# Altium schematic sheet MainBoard.SchDoc
size A2; Organization: Altium Limited; Address1: L3, 12a Rodborough Rd; Address2: Frenchs Forest; Address3: NSW; Address4: Australia 2086
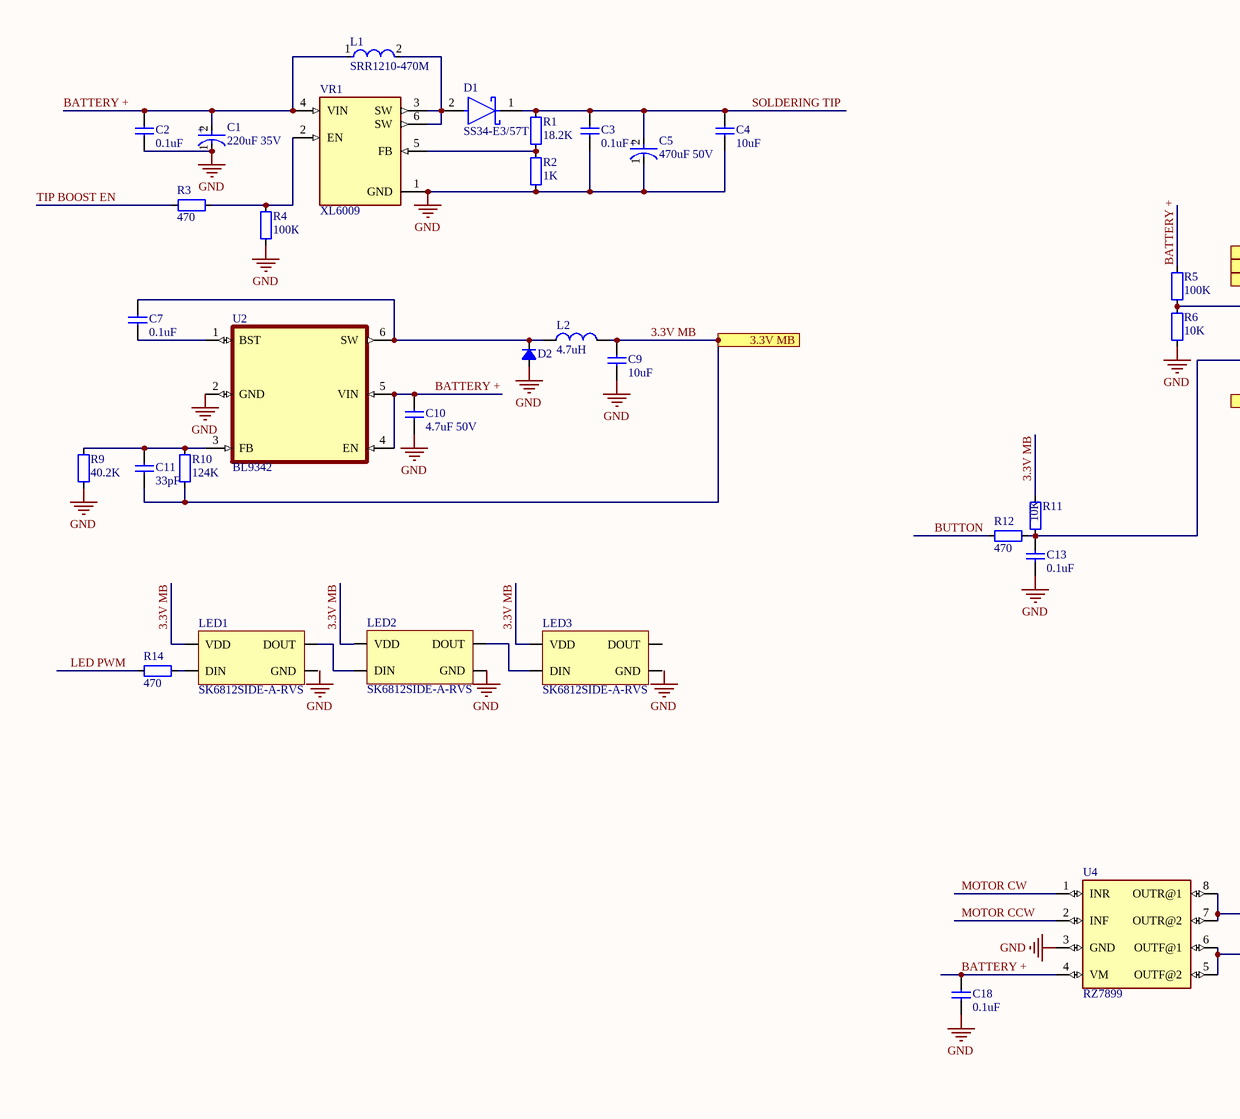
[diagram p0: MainBoard.SchDoc, left]
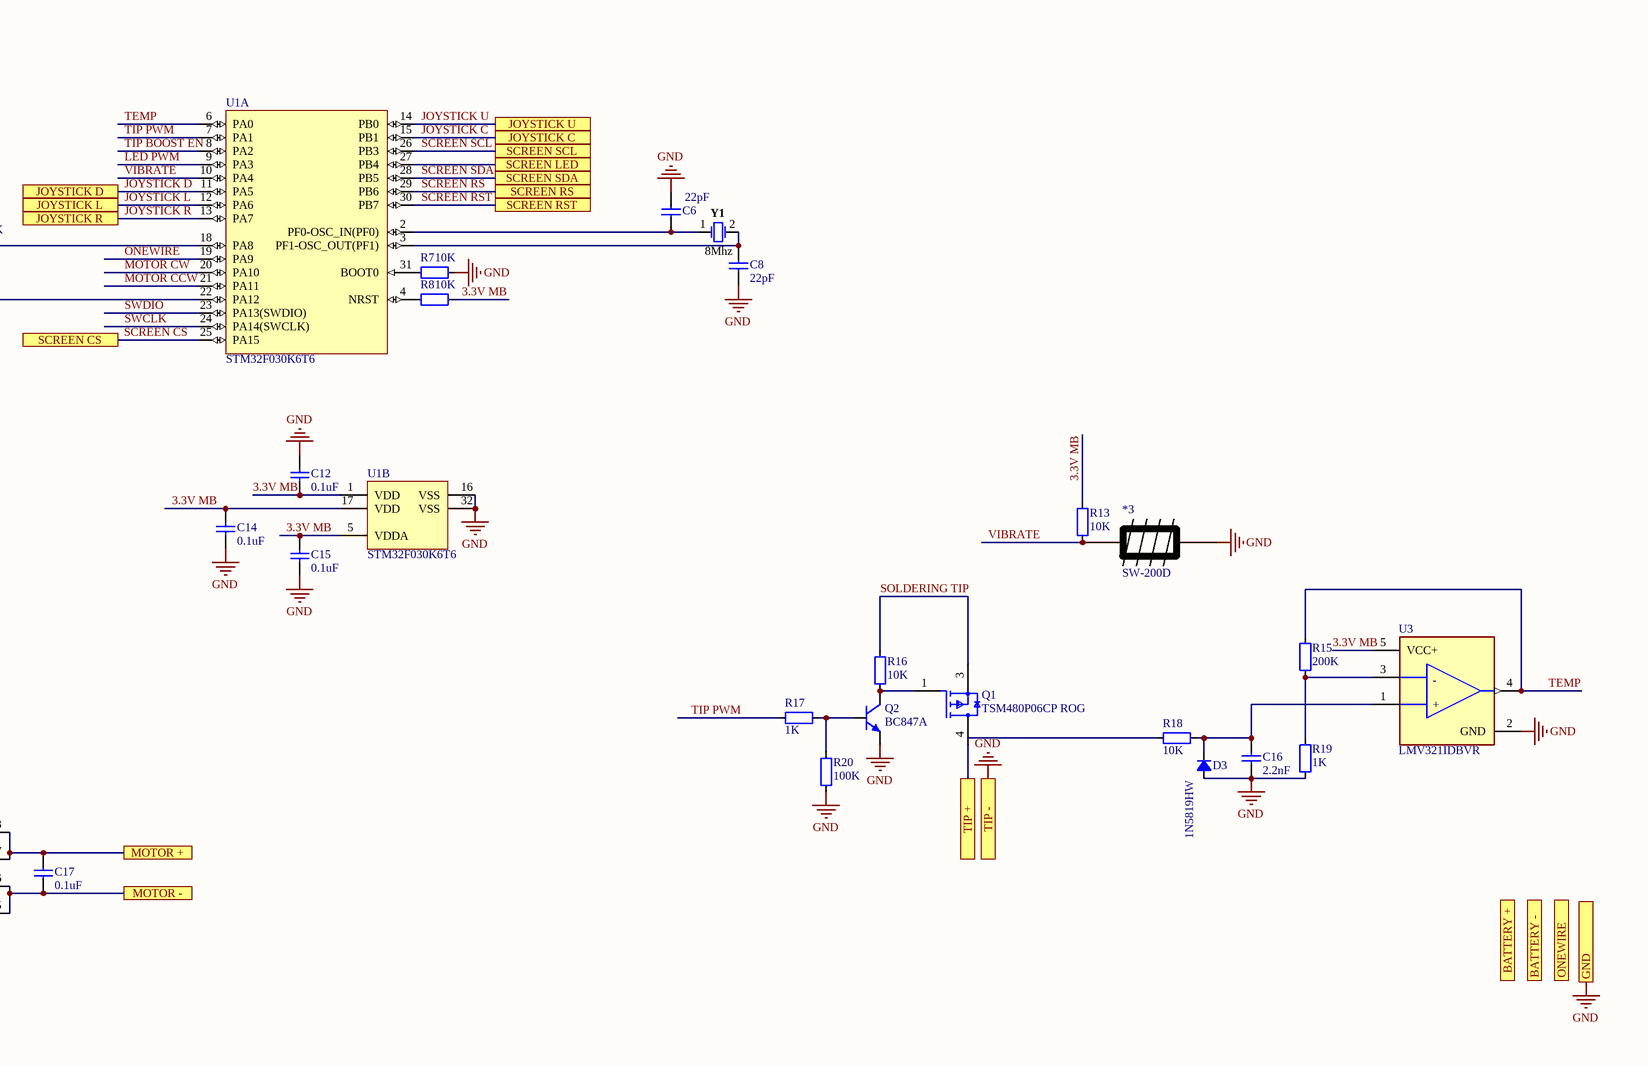
[diagram p1: MainBoard.SchDoc, right]

## Parts
*3  SW-200D  [SW-200D]
C1  220uF 35V  [FP-RAD-TH-D_8_0_5-L_15_1-MFG]
C2  0.1uF  [1206]
C3  0.1uF  [1206]
C4  10uF  [CAPC1005X04L]
C5  470uF 50V  [FP-RAD-TH-D_10_0_5-L_20_2-MFG]
C6  22pF  [R0603]
C7  0.1uF  [C0805]
C8  22pF  [R0603]
C9  10uF  [C0805]
C10  4.7uF 50V  [C0805]
C11  33pF  [C0805]
C12  0.1uF  [1206]
C13  0.1uF  [R0603]
C14  0.1uF  [1206]
C15  0.1uF  [1206]
C16  2.2nF  [C0805]
C17  0.1uF  [1206]
C18  0.1uF  [1206]
D1  SS34-E3/57T  [FP-95402-MFG]
D2  (no value)  [SOD-123]
D3  1N5819HW  [SOD-123]
L1  SRR1210-470M  [FP-SRR1210-MFG]
L2  4.7uH  [CDRH3D16NP]
LED1  SK6812SIDE-A-RVS  [SK6812SIDE-A-RVS]
LED2  SK6812SIDE-A-RVS  [SK6812SIDE-A-RVS]
LED3  SK6812SIDE-A-RVS  [SK6812SIDE-A-RVS]
Q1  TSM480P06CP ROG  [FP-TO-252-MFG]
Q2  BC847A  [SOT95P237X112-3N]
R1  18.2K  [C0805]
R2  1K  [C0805]
R3  470  [C0805]
R4  100К  [C0805]
R5  100K  [C0805]
R6  10K  [C0805]
R7  10K  [C0805]
R8  10K  [C0805]
R9  40.2K  [C0805]
R10  124K  [C0805]
R11  10K  [R0603]
R12  470  [R0603]
R13  10K  [C0805]
R14  470  [C0805]
R15  200K  [C0805]
R16  10K  [C0805]
R17  1K  [C0805]
R18  10K  [C0805]
R19  1K  [C0805]
R20  100K  [C0805]
U1  STM32F030K6T6  [LQFP32_L]  (parts A,B of 2)
U2  BL9342  [SOT50P160X60-6N]
U3  LMV321IDBVR  [FP-DBV0005A-MFG]
U4  RZ7899  [SOP-8_2-5R1S-IPC_B]
VR1  XL6009  [DPAK170P1435X465-6N]
Y1  8Mhz  [FOX-HC49SDLF_V]

## Ports
3.3V MB, BATTERY +, BATTERY -, GND, JOYSTICK C, JOYSTICK D, JOYSTICK L, JOYSTICK R, JOYSTICK U, MOTOR +, MOTOR -, ONEWIRE, SCREEN CS, SCREEN LED, SCREEN RS, SCREEN RST, SCREEN SCL, SCREEN SDA, TIP +, TIP -

## Nets
GND: *3.2 C1.1(C) C2.1 C3.1 C4.1 C5.1(C) C6.1 C8.1 C9.1 C10.1 C12.2 C13.1 C14.2 C15.2 C16.1 C18.2 D2.1(A) D3.1(A) LED2.4(GND) Q2.2(E) R2.2 R4.2 R6.1 R7.1 R9.1 R19.2 R20.1 U1.16(VSS) U1.32(VSS) U2.2(GND) U3.2(GND) U4.3(GND) VR1.1(GND) ; port TIP -, port GND
3.3V MB: C9.2 C11.1 C12.1 C14.1 C15.1 L2.2 LED1.2(VDD) LED2.2(VDD) LED3.2(VDD) R8.1 R10.1 R11.1 R13.2 U1.1(VDD) U1.5(VDDA) U1.17(VDD) U3.5(VCC+) ; port 3.3V MB
BATTERY +: C1.2(A) C2.2 C10.2 C18.1 L1.1 R5.2 U2.4(EN) U2.5(VIN) U4.4(VM) VR1.4(VIN)
BUTTON: R12.1
JOYSTICK D: U1.11(PA5) ; port JOYSTICK D
JOYSTICK L: U1.12(PA6) ; port JOYSTICK L
JOYSTICK R: U1.13(PA7) ; port JOYSTICK R
JOYSTICK U: U1.14(PB0) ; port JOYSTICK U
JOYSTICK С: U1.15(PB1) ; port JOYSTICK C
LED PWM: R14.2 U1.9(PA3)
MOTOR +: C17.1 U4.7(OUTR@2) U4.8(OUTR@1) ; port MOTOR +
MOTOR -: C17.2 U4.5(OUTF@2) U4.6(OUTF@1) ; port MOTOR -
MOTOR CCW: U1.21(PA11) U4.2(INF)
MOTOR CW: U1.20(PA10) U4.1(INR)
ONEWIRE: U1.19(PA9)
SCREEN CS: U1.25(PA15) ; port SCREEN CS
SCREEN LED: U1.27(PB4) ; port SCREEN LED
SCREEN RS: U1.29(PB6) ; port SCREEN RS
SCREEN RST: U1.30(PB7) ; port SCREEN RST
SCREEN SCL: U1.26(PB3) ; port SCREEN SCL
SCREEN SDA: U1.28(PB5) ; port SCREEN SDA
SOLDERING TIP: C3.2 C4.2 C5.2(A) D1.1(C) Q1.3(Source) R1.1 R16.2
SWCLK: U1.24(PA14(SWCLK))
SWDIO: U1.23(PA13(SWDIO))
TEMP: R15.1 U1.6(PA0) U3.4(OUT)
TIP +: Q1.4(Drain) ; port TIP +
TIP BOOST EN: R3.2 U1.8(PA2)
TIP PWM: R17.2 U1.7(PA1)
VIBRATE: *3.1 R13.1 U1.10(PA4)
NetC6_2: C6.2 U1.2(PF0-OSC_IN(PF0)) Y1.1
NetC7_1: C7.1 U2.1(BST)
NetC7_2: C7.2 D2.2(K) L2.1 U2.6(SW)
NetC8_2: C8.2 U1.3(PF1-OSC_OUT(PF1)) Y1.2
NetC11_2: C11.2 R9.2 R10.2 U2.3(FB)
NetC13_2: C13.2 R11.2 R12.2 U1.22(PA12)
NetC16_2: C16.2 D3.2(K) R18.2 U3.1(1IN+)
NetD1_2: D1.2(A) L1.2 VR1.3(SW) VR1.6(SW)
NetLED1_1: LED1.1(DIN) R14.1
NetLED1_3: LED1.3(DOUT) LED2.1(DIN)
NetLED2_3: LED2.3(DOUT) LED3.1(DIN)
NetQ1_1: Q1.1(Gate) Q2.3(C) R16.1
NetQ2_1: Q2.1(B) R17.1 R20.2
NetR1_2: R1.2 R2.1 VR1.5(FB)
NetR3_1: R3.1 R4.1 VR1.2(EN)
NetR5_1: R5.1 R6.2 U1.18(PA8)
NetR7_2: R7.2 U1.31(BOOT0)
NetR8_2: R8.2 U1.4(NRST)
NetR15_2: R15.2 R19.1 U3.3(1IN-)

Not connected (* = marked no-connect by the designer): LED1 4(GND); LED3 3(DOUT) 4(GND); R18 1

## Notes on the sheet
- Labels drawn without touching a wire or pin: GND
- Title
- Size:
- Date:
- File:
- A2
- Number:
- Time:
- Revision:
- Sheet
- of
- (in symbol CAP 10x20) +
- (in symbol CMP-05427-000678-1) +
- (in symbol LMV321) -; +

## Library data of the parts
C1 = CMP-05427-000678-1: Aluminum Electrolytic Capacitors (Radial Lead Type) 220uF ±20% 35V; Ripple Current: 1.24A; Impedance: 41mR; Lead Length: 17mm; Life (Hours): 3000Hour; Lead Diameter: 0.6mm; Dielectric Material: Aluminium; Dissipation Factor: 0.12%; Package Quantity: 200; Tolerance: 20%; Series: FM; Voltage Rating: 35V; Lead Pitch: 3.5mm; Radiation Hardening: No; Construction: RADIAL; RoHS Compliant: Yes; REACH SVHC: Yes; Lead Free: Lead Free; Height - Seated (Max): 0.65inch; Length: 15mm; Diameter: 8mm; Mount: Through Hole; Number of Pins: 2; Height: 15mm; Voltage: 35V; Case/Package: Radial; Packaging: Bulk; Min Operating Temperature: -40°C; Voltage Rating (DC): 35V; ESR (Equivalent Series Resistance): 41mR; Capacitance: 220uF; Max Operating Temperature: 105°C; Termination: Radial
C2-C4 C6-C18 = CAP
  C2 C3 C7 C12-C15 C17 C18: Value: 0.1uF
  C4 C9: Value: 10uF
  C6 C8: Value: 22pF
  C10: Value: 4.7uF 50V
  C11: Value: 33pF
  C16: Value: 2.2nF
C5 = CAP 10x20: Aluminum Electrolytic Capacitors (Radial Lead Type) 10uF ±20% 400V; Lead/Base Style: Straight; Lead Diameter: 0.6mm; Dissipation Factor: 0.24%; Ripple Current (AC): 80mA; Life (Hours): 2000Hour; Polarity: Polar; Dielectric Material: Aluminium; Lead Free: Lead Free; Capacitance: 10uF; Tolerance: 20%; Height: 20mm; Number of Pins: 2; Case/Package: Radial; Package Quantity: 200; REACH SVHC: No SVHC; Termination: Radial; Radiation Hardening: No; Diameter: 10mm; RoHS Compliant: Yes; Construction: RADIAL; Max Operating Temperature: 105°C; Voltage Rating: 400V; Mount: Through Hole; Voltage: 400V; Height - Seated (Max): 0.866inch; Lead Pitch: 5mm; Voltage Rating (DC): 400V; Contact Plating: Tin; Length: 20mm; Series: NHG; Min Operating Temperature: -25°C; Packaging: Bulk; Ripple Current: 80mA
D1 = SS34: DIODE SCHOTTKY 40V 3A DO214AB; Manufacturer: Vishay; Max Junction Temp: +150°C; Peak Reverse Current: 0.5mA; Max Surge Forward Current: 100A; Standoff Height: 0mm; ComponentLink2Description: Datasheet; Device Class L3: Schottky Diodes; Height: 2.62mm; Max Repetitive Reverse Voltage: 40V; Lead Free: Yes; Package: 95402; Temperature Range High: +150°C; ComponentLink2URL: http://www.vishay.com/docs/88751/ss32.pdf; Temperature: -55°C to +150°C; Footprint Url: http://www.vishay.com/docs/95402/smc.pdf; Automotive: No; Forward Current: 3A; Category: Diode; Manufacturer Part Number: SS34-E3/57T; RoHS: TRUE; Device Class L2: Diodes; Mouser Description: Schottky Diodes & Rectifiers 3.0 Amp 40 Volt; Octopart: https://octopart.com/ss34-e3%2F57t-vishay-39552907; Temperature Range Low: -55°C; Device Class L1: Discrete Semiconductors; Digikey Description: DIODE SCHOTTKY 40V 3A DO214AB
D2 = Diode_SOD123: Schottky diode SOD123; Note: Schottky diode  SOD123
D3 = Diode_SOD123: Schottky diode SOD123 1N5819HW; Note: Schottky diode  SOD123
L1 = SRR1210: FIXED IND  102 MOHM SMD; Manufacturer: Bourns; Manufacturer Part Number: SRR1210-680M; Inductance: 68uH; Rms Current: 3A; Shielding: true; Q Factor: 12; Value: 68uH; Series Resistance: 102mΩ; Saturation Current: 2.7A; Tolerance: 20%; Core Material: Ferrite; Self Resonant Frequency: 3.8MHz; Test Frequency: 2.52MHz; ComponentLink2Description: Datasheet; Device Class L3: Fixed Inductors; Lead Free: Yes; Composition: Wirewound; Temperature: -40°C to +125°C; Automotive: No; RoHS: TRUE; Category: Ind; Device Class L2: Inductors; Height: 10mm; Temperature Range Low: -40°C; Package: SRR1210; Device Class L1: Passive Components; Temperature Range High: +125°C; Mouser Description: Fixed Inductors 68uH 20% SMD 1210; ComponentLink2URL: https://www.bourns.com/docs/Product-Datasheets/SRR1210.pdf; Digikey Description: FIXED IND 68UH 3A 102 MOHM SMD; Octopart: https://octopart.com/srr1210-680m-bourns-10487145
L2 = CDRH3D16NP: 4,7µH Shielded Inductor 900mA 140mOhm Max Nonstandard; Manufacturer: Sumida; Manufacturer Part Number: CDRH3D16NP-100NC; Note: 4.7µH Shielded Inductor 550mA 140mOhm; Value: 4.7uH
LED1-LED3 = SK6812SIDE-A-RVS: 2mA -40℃~+85℃ RGB SMD,2x4mm Light Emitting Diodes (LED) ROHS
Q1 = TSM480P06CP ROG: MOSFET P-CHANNEL 60V 20A TO252; Rds On Max: 48mR; Max Power Dissipation: 66W; Input Capacitance: 1.25nF; Mount: Surface Mount; Case/Package: TO-252-3; Min Operating Temperature: -50°C; Continuous Drain Current (ID): 20A; Drain to Source Voltage (Vdss): 60V; Packaging: Cut Tape; RoHS Compliant: Yes; Max Operating Temperature: 150°C
Q2 = BC846A: NPN Silicon AF Transistor, 45 V VCEO, 100 mA IC, SOT23, Reel, Green; Manufacturer: DIOTEC; Note: NPN Silicon AF Transistor, 45 V VCEO, 100 mA IC, SOT23, Reel, Green; ComponentLink3URL: http://www.infineon.com/dgdl/SOT23-Package_Overview.pdf?folderId=db3a30431936bc4b0119532290053c66&fileId=db3a30431936bc4b0119533468123c85; ComponentLink3Description: Package Specification; ComponentLink2URL: http://www.infineon.com/dgdl/bc847series_bc848series_bc849series_bc850series.pdf?folderId=db3a304314dca389011541d30fa21656&fileId=db3a304314dca389011541d4630a1657; ComponentLink1URL: http://www.infineon.com/; ComponentLink2Description: Datasheet; ComponentLink1Description: Manufacturer URL; Manufacturer Part Number: BC847A
R1-R20 = RES SMD UNI: Resistor SMD; Category: Resistors
  R1: Value: 18.2K
  R2 R17 R19: Value: 1K
  R3 R12 R14: Value: 470
  R4: Value: 100К
  R5 R20: Value: 100K
  R6-R8 R11 R13 R16 R18: Value: 10K
  R9: Value: 40.2K
  R10: Value: 124K
  R15: Value: 200K
U1 = CMP-0304-00020-2: ARM Cortex-M0 32-bit MCU, 32 KB Flash, 4 KB Internal RAM, 26 I/Os, 32-pin LQFP, -40 to 85 degC, Tray; I/Os (High Current): 26; FLASH Size (Prog) (kB): 32; Operating Frequency(F) (Processor speed) (MHz): 48; Supply Voltage(Vcc) min (V): 2.4; Internal RAM Size (kB): 4; PackageDescription: 32-Pin Low Profile Quad Flat Package, 7 x 7 mm Body, 0.8 mm Pitch; Core: ARM Cortex-M0; PackageVersion: Rev. 1, 07/2013; ComponentLink1Description: Manufacturer URL; ComponentLink2URL: http://www.st.com/st-web-ui/static/active/en/resource/technical/document/datasheet/DM00088500.pdf; PackageReference: LQFP32; PartNumber: STM32F030K6T6; Mounting Technology: Surface Mount; DatasheetVersion: Rev. 1; ComponentLink2Description: Datasheet; ComponentLink3URL: http://www.st.com/st-web-ui/static/active/en/resource/technical/document/datasheet/DM00088500.pdf; ComponentLink1URL: http://www.st.com/web/en/home.html; ComponentLink3Description: Package Specification; Packing: Tray
U2 = BL9342: MF: {'manufacturer': u'Texas Instruments'}; Package: None; MP: BL9342; Value: *; Price: None; Availability: Unavailable
U3 = LMV321: IC OPAMP GP 1 CIRCUIT SOT23-5; Manufacturer: Texas Instruments; Bandwidth: 1MHz; Number Of Channels: 1; Max Junction Temp: +150°C; Input Offset Voltage: 1.7mV; Standoff Height: 0mm; Voltage Gain: 100V/mV; Min Supply Voltage: 2.7V; Input Bias Current: 0.015uA; Nominal Supply Current: 80-130uA; Max Supply Voltage: 5.5V; Ambient Temperature Range Low: -40°C; Device Class L3: Amplifiers - Op Amps; Package: DBV0005A; Temperature: -40°C to +125°C; Automotive: No; Ambient Temperature Range High: +125°C; ComponentLink2Description: Datasheet; Manufacturer Part Number: LMV321IDBVR; Octopart: https://octopart.com/lmv321idbvr-texas+instruments-410381; ComponentLink2URL: http://www.ti.com/lit/ds/symlink/lmv321.pdf; Temperature Range High: +125°C; Device Class L1: Integrated Circuits (ICs); Temperature Range Low: -40°C; Digikey Description: IC OPAMP GP 1 CIRCUIT SOT23-5; RoHS: TRUE; Height: 1.45mm; Mouser Description: Operational Amplifiers - Op Amps Low V R/R; Device Class L2: Linear ICs; Gain Bandwidth: 1MHz; Lead Free: Yes; Category: IC
U4 = RZ7899: MF: {'manufacturer': u'Wuxi'}; Availability: Unavailable; Value: *; Package: None; Price: None; MP: RZ7899
VR1 = XL6009: The XL6009 regulator is a wide input range, current mode, DC/DC converter which is capable of generating either positive or negative output voltages.; MF: {'manufacturer': u'XLSEMI'}; Price: None; Package: None; Availability: Unavailable; Value: *; MP: XL6009
Y1 = CMP-2100-03639-1: Resistance Weld Crystal, 8 MHz, +/- 30 ppm, -20 to 70 degC, 2-Pin SMD, RoHS, Tape and Reel; Manufacturer: FOX Electronics; Series Resistance: 80Ohm; Load Capacitance: 20pF; Tolerance: 50ppm; Frequency Tolerance: 30ppm; Datasheet URL: http://www.foxonline.com/pdfs/hc49sdlf.pdf; Package Reference: HC49SDLF; Height: 4.5mm; Mount: SurfaceMount; Packaging: TapeandReel; Length: 11.7mm; Termination: SMD/SMT; Number of Pins: 2; Depth: 5mm; Frequency: 8MHz; Min Operating Temperature: -20degC; Package Quantity: 1000; RoHSCompliant: True; Lead Free: LeadFree; Width: 5mm; Case/Package: SMD/SMT; Manufacturer URL: http://www.foxonline.com/; Max Operating Temperature: 70degC; REACH SVHC: NoSVHC; Datasheet Version: 42064.0; Package Description: 2-Pin Surface Mount Device, Body 5 x 11.7 mm; Frequency Stability: 50ppm; ESR (Equivalent Series Resistance): 80Ohm; Radiation Hardening: No